# EAGLE design componentes1 (EAGLE 9.6.2)

## Sheet 1 of 2
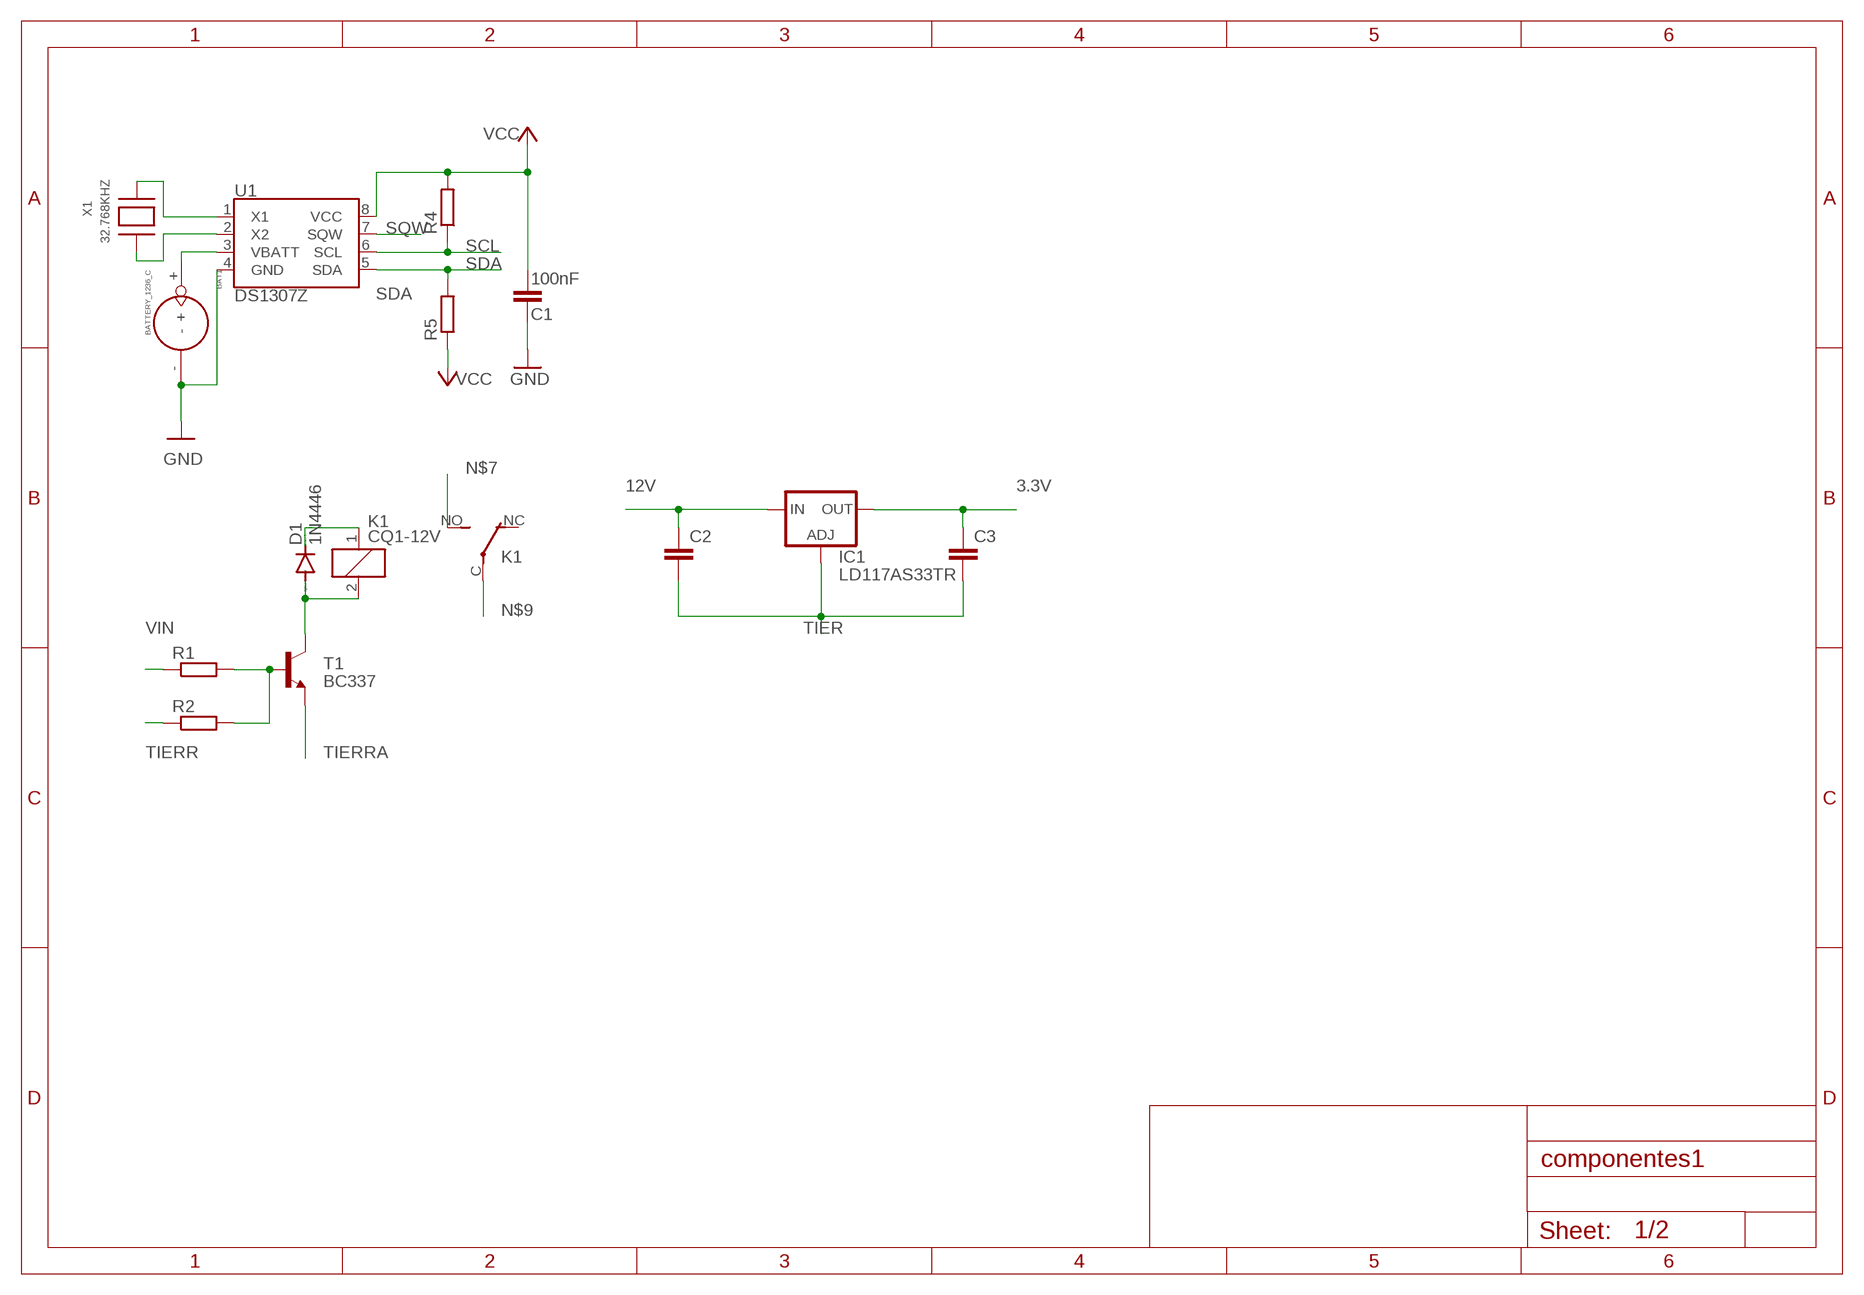
[diagram p0: schematic, sheet 1]

### Parts
BAT1  BATTERY_1236_C  [BATTERY_1236_C]
C1  100nF  C-EUC0603  [C0603]
C2  C-EU050-025X075  [C050-025X075]
C3  C-EU050-025X075  [C050-025X075]
D1  1N4446  [DO35-10]
IC1  LD117AS33TR  [SOT223]
K1  CQ1-12V  [CQ1]
R1  R-EU_0207/10  [0207/10]
R2  R-EU_0207/10  [0207/10]
R4  R-EU_0207/10  [0207/10]
R5  R-EU_0207/10  [0207/10]
T1  BC337  [TO92]
U1  DS1307Z  [SO08-0.15]
X1  32.768KHZ  XTAL-3.2X1.5  [XTAL3215]

### Nets
3.3V: C3.1 IC1.4(OUT) ; also sheet 2
12V: C2.1 IC1.3(IN)
GND: BAT1.- C1.1 U1.4(GND) ; also sheet 2
N$1: U1.1(X1) X1.P$2
N$2: U1.2(X2) X1.P$1
N$3: D1.A K1.2 T1.3(C)
N$4: BAT1.+ U1.3(VBATT)
N$5: D1.C K1.1
N$6: R1.2 R2.2 T1.2(B)
N$7: K1.NO(2:S)
N$9: K1.C(2:P)
SCL: R4.1 U1.6(SCL)
SDA: R5.2 U1.5(SDA)
SQW: U1.7(SQW)
TIER: C2.2 C3.2 IC1.1(ADJ)
TIERR: R2.1
TIERRA: T1.1(E)
VCC: C1.2 R4.2 R5.1 U1.8(VCC) ; also sheet 2
VIN: R1.1
Unconnected: K1.NC(2:O)

## Sheet 2 of 2
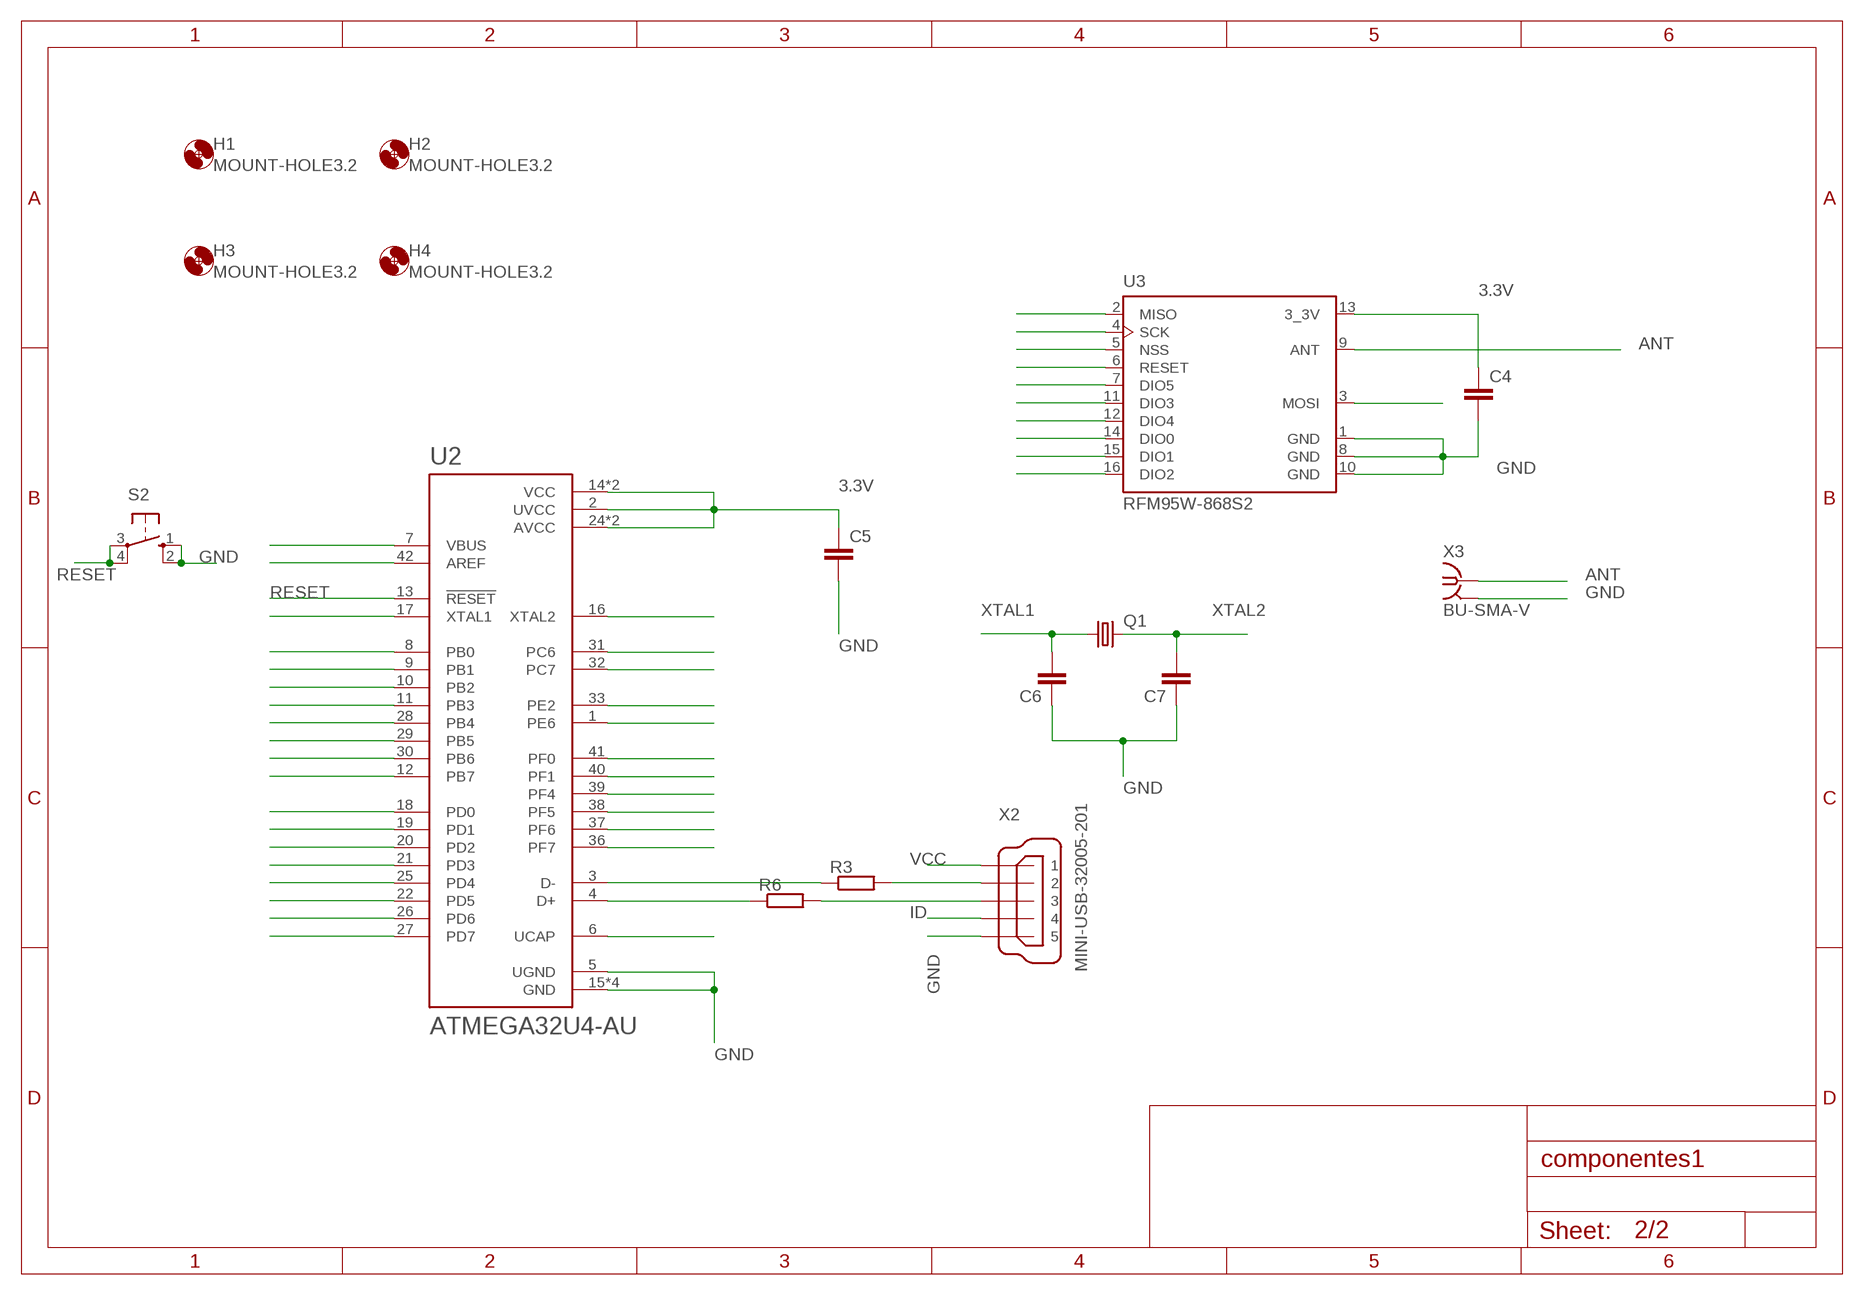
[diagram p1: schematic, sheet 2]

### Parts
C4  C-EU050-025X075  [C050-025X075]
C5  C-EU050-025X075  [C050-025X075]
C6  C-EU050-025X075  [C050-025X075]
C7  C-EU050-025X075  [C050-025X075]
H1  MOUNT-HOLE3.2  [3,2]
H2  MOUNT-HOLE3.2  [3,2]
H3  MOUNT-HOLE3.2  [3,2]
H4  MOUNT-HOLE3.2  [3,2]
Q1  CRYSTALHC49S  [HC49/S]
R3  R-EU_0204/7  [0204/7]
R6  R-EU_0204/7  [0204/7]
S2  40-XX  [B3F-40XX]
U2  ATMEGA32U4-AU  [QFP80P1200X1200X120-44N]
U3  RFM95W-868S2  [XCVR_RFM95W-868S2]
X2  MINI-USB-32005-201  [32005-201]
X3  BU-SMA-V  [BU-SMA-V]

### Nets
3.3V: C4.1 C5.1 U2.2(UVCC) U2.14(VCC) U2.24(AVCC) U2.34(VCC) U2.44(AVCC) U3.13(3_3V) ; also sheet 1
ANT: U3.9(ANT) X3.1
GND: C4.2 C5.2 C6.1 C7.1 S2.1(S) S2.2(S1) U2.5(UGND) U2.15(GND) U2.23(GND) U2.35(GND) U2.43(GND) U3.1(GND) U3.8(GND) U3.10(GND) X2.5 X3.2 X3.3 X3.4 X3.5 ; also sheet 1
ID: X2.4
N$8: U2.7(VBUS)
N$10: U2.42(AREF)
N$11: U2.17(XTAL1)
N$12: U2.8(PB0)
N$13: U2.9(PB1)
N$14: U2.10(PB2)
N$15: U2.11(PB3)
N$16: U2.28(PB4)
N$17: U2.29(PB5)
N$18: U2.30(PB6)
N$19: U2.12(PB7)
N$20: U2.18(PD0)
N$21: U2.19(PD1)
N$22: U2.20(PD2)
N$23: U2.21(PD3)
N$24: U2.25(PD4)
N$25: U2.22(PD5)
N$26: U2.26(PD6)
N$27: U2.27(PD7)
N$28: U2.6(UCAP)
N$29: R3.1 U2.3(D-)
N$30: U2.36(PF7)
N$31: U2.37(PF6)
N$32: U2.38(PF5)
N$33: U2.39(PF4)
N$34: U2.40(PF1)
N$35: U2.41(PF0)
N$36: U2.1(PE6)
N$37: U2.32(PC7)
N$38: U2.31(PC6)
N$39: U2.16(XTAL2)
N$40: R3.2 X2.2
N$41: U3.6(RESET)
N$42: R6.2 X2.3
N$43: R6.1 U2.4(D+)
N$44: U2.33(PE2)
N$45: U3.2(MISO)
N$46: U3.4(SCK)
N$47: U3.5(NSS)
N$49: U3.7(DIO5)
N$50: U3.11(DIO3)
N$51: U3.12(DIO4)
N$52: U3.14(DIO0)
N$53: U3.15(DIO1)
N$54: U3.16(DIO2)
N$58: U3.3(MOSI)
RESET: S2.3(P) S2.4(P1) U2.13(!RESET)
VCC: X2.1 ; also sheet 1
XTAL1: C6.2 Q1.1
XTAL2: C7.2 Q1.2

## Library data of the parts
BAT1 = Itead_BP_110825.lbr:BATTERY_1236_C: SOC004
C1-C7 = rcl:C-EU: CAPACITOR, European symbol; SPICEPREFIX: C
D1 = diode:1N4446: DIODE high speed (Philips)
H1-H4 = holes:MOUNT-HOLE: MOUNTING HOLE with drill center marker
IC1 = v-reg:LD117A?*: Low drop fixed and adjustable positive voltage regulators 1 A Source: http://www.st.com/stonline/products/literature/ds/7194/ld1117axx.pdf
K1 = relay:CQ1-12V: AUTOMOTIVE QUIET RELAY NAiS Source: http://www.mew-europe.com/.. en_ds_61208_0000.pdf; OC_FARNELL: unknown; OC_NEWARK: unknown
Q1 = crystal:CRYSTAL: CRYSTAL; OC_FARNELL: 1667008; OC_NEWARK: unknown
R1-R6 = rcl:R-EU_: RESISTOR, European symbol; SPICEPREFIX: R
S2 = switch-omron:40-XX: OMRON SWITCH; MF: OMRON COMPONENTS USA; MPN: B3F-4000; OC_FARNELL: 176434; OC_NEWARK: 36K3105
T1 = transistor:BC337: NPN TRANSISTOR
U1 = SparkFun-Clocks:DS1307: Maxim DS1307 - I2C Real-time clock (RTC) The DS1307 serial real-time clock (RTC) is a low-power, full binary-coded decimal (BCD) clock/calendar plus 56 bytes of NV SRAM. Address and data are transferred serially through an I2C, bidirectional bus. The clock/calendar provides seconds, minutes, hours, day, date, month, and year information. SparkFun Products: Real Time Clock Module <https://www.sparkfun.com/products/12708> (BOB-12708) Datasheet <https://cdn.sparkfun.com/datasheets/BreakoutBoards/DS1307.pdf>; PROD_ID: IC-08138
U2 = ATMEGA32U4-AU:ATMEGA32U4-AU: ATmega Series 16 MHz 32 KB Flash 2.5 KB SRAM 8-Bit Microcontroller - TQFP-44 Check availability <https://pricing.snapeda.com/parts/ATMEGA32U4-AU/Rochester%20Electronics%2C%20LLC/view-part?ref=eda>; AVAILABILITY: In Stock; DESCRIPTION: AVR AVR® ATmega Microcontroller IC 8-Bit 16MHz 32KB (16K x 16) FLASH 44-TQFP (10x10); MF: Rochester Electronics, LLC; MP: ATMEGA32U4-AU; PACKAGE: None; PRICE: None; PURCHASE-URL: https://pricing.snapeda.com/search/part/ATMEGA32U4-AU/?ref=eda
U3 = RFM95W-868S2:RFM95W-868S2: Mod Txrx Lora +20dbm 868mhz Smd Check availability <https://pricing.snapeda.com/parts/RFM95W-868S2/RF/view-part?ref=eda>; AVAILABILITY: In Stock; DESCRIPTION: General ISM < 1GHz LoRa™ Transceiver Module 868MHz Antenna Not Included Surface Mount; MF: RF; MP: RFM95W-868S2; PACKAGE: SMD-16 Hope Microelectronics; PRICE: None; PURCHASE-URL: https://pricing.snapeda.com/search/part/RFM95W-868S2/?ref=eda
X1 = adafruit:XTAL: Low cost SMT crystals, no capacitors included http://www.ladyada.net/library/eagle
X2 = con-cypressindustries:MINI-USB-: MINI USB-B Conector Source: www.cypressindustries.com; OC_FARNELL: unknown; OC_NEWARK: unknown
X3 = con-coax:BU-SMA-V: FEMALE SMA CONNECTOR Radiall distributor RS 112-3794; OC_FARNELL: unknown; OC_NEWARK: unknown

## Board
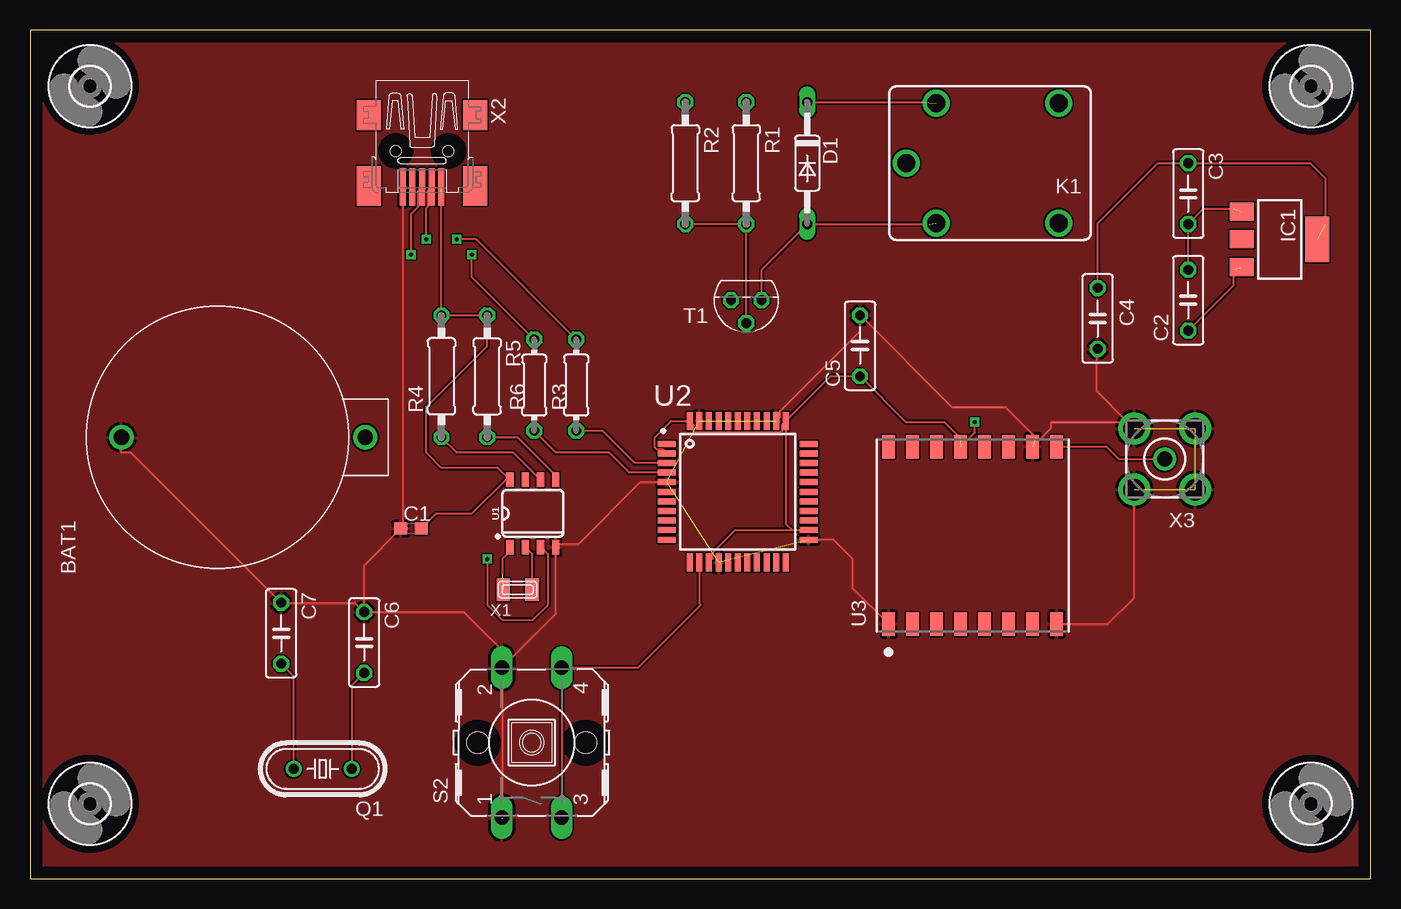
[diagram p2: board, top side]
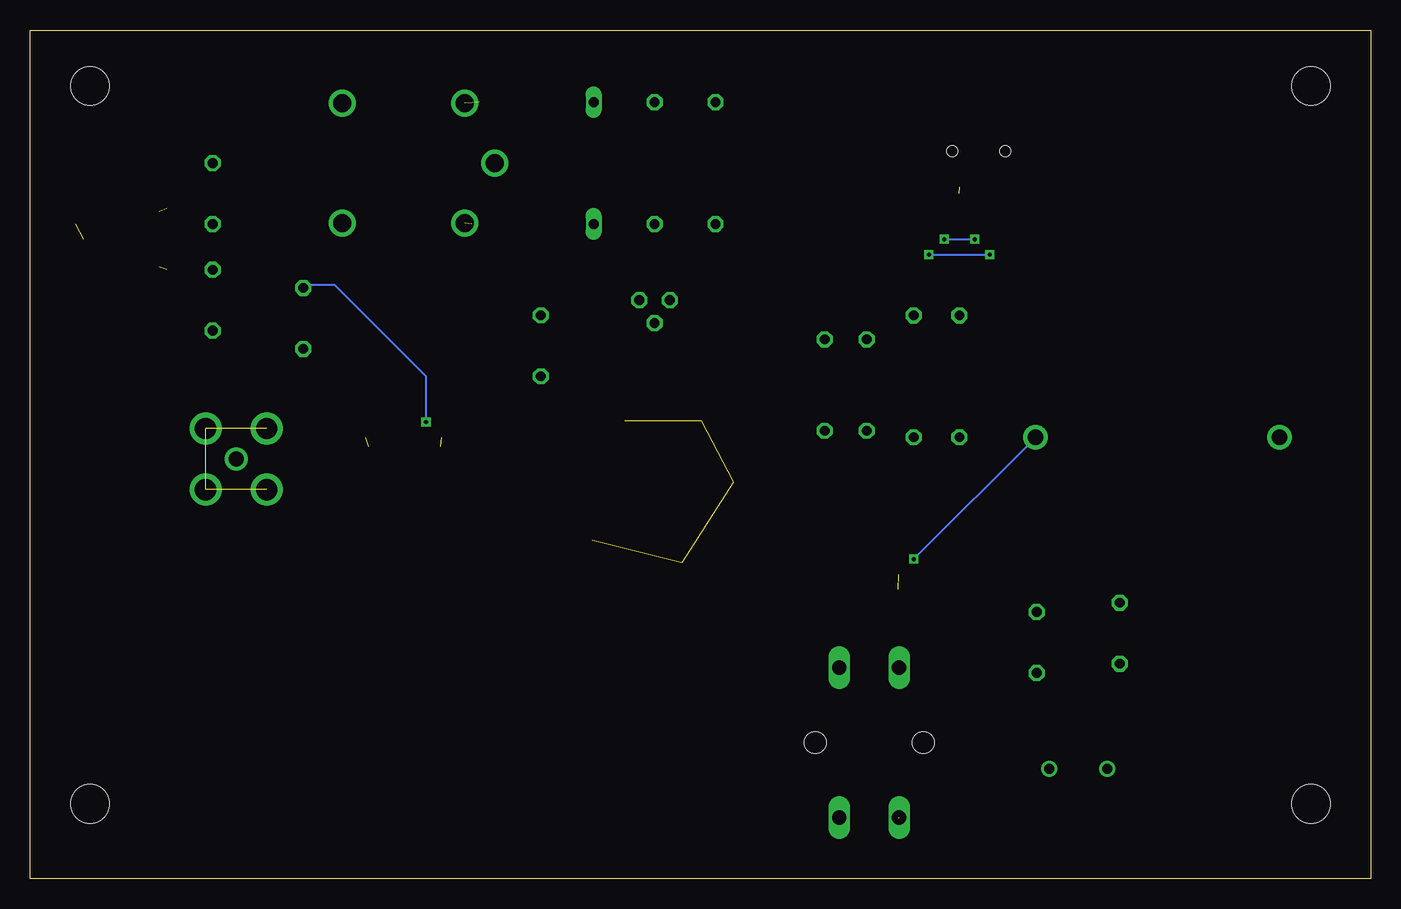
[diagram p3: board, bottom side, seen from below]

Size 111.74 x 70.79 mm. Coordinates in mm from the lower left corner, seen from the top.
Outline: 0,0 111.74,0 111.74,70.79 0,70.79 0,0
Copper layers (1*16): Top 0.035mm / dielectric 1.5mm / Bottom 0.035mm
Design rules "default": minimum track width 6mil, minimum drill 0.35mm, track to track 6mil, track to pad 6mil, pad to pad 6mil, via to via 6mil, smd to smd 6mil, copper to edge 40mil, drill to drill 6mil, minimum pad ring 10mil, minimum via ring 8mil, stop-mask expansion 4mil, vias tented up to drill 0mil, thermal gap 10mil

### Footprints (pad centres in the part's own frame; a part is rotated, then mirrored left to right if it is on the bottom)
BATTERY_1236_C = drill 1.27 pad 2.032: + 0,0; - 0,20.32
C0603 = smd 1.1 x 1: 1 -0.85,0; 2 0.85,0
C050-025X075 = drill 0.813 octagon: 1 -2.54,0; 2 2.54,0
DO35-10 = drill 0.813 long: A 5.08,0; C -5.08,0
3,2 = hole 3.2: 0,0
SOT223 = smd 1.5 x 2: 1 -2.3,-3.15; 2 0,-3.15; 3 2.3,-3.15 | smd 3.8 x 2: 4 0,3.15
CQ1 = drill 1.5: 1 4.5,-5; 2 4.5,5; C 7,0; NC -5.7,-5; NO -5.7,5
HC49/S = drill 0.813: 1 -2.413,0; 2 2.413,0
0207/10 = drill 0.813 octagon: 1 -5.08,0; 2 5.08,0
0204/7 = drill 0.813 octagon: 1 -3.81,0; 2 3.81,0
B3F-40XX = drill 1.194 long: 1 -6.248,2.489; 2 6.248,2.489; 3 -6.248,-2.489; 4 6.248,-2.489 | hole 1.803: 0,-4.496; 0,4.496
TO92 = drill 0.813 octagon: 1 1.27,0; 2 0,1.905; 3 -1.27,0
SO08-0.15 = smd 0.6 x 1.2: 1 -1.905,-2.8; 2 -0.635,-2.8; 3 0.635,-2.8; 4 1.905,-2.8; 5 1.905,2.8; 6 0.635,2.8; 7 -0.635,2.8; 8 -1.905,2.8
QFP80P1200X1200X120-44N = smd 1.5 x 0.5: 1 -5.9,4; 2 -5.9,3.2; 3 -5.9,2.4; 4 -5.9,1.6; 5 -5.9,0.8; 6 -5.9,0; 7 -5.9,-0.8; 8 -5.9,-1.6; 9 -5.9,-2.4; 10 -5.9,-3.2; 11 -5.9,-4; 23 5.9,-4; 24 5.9,-3.2; 25 5.9,-2.4; 26 5.9,-1.6; 27 5.9,-0.8; 28 5.9,0; 29 5.9,0.8; 30 5.9,1.6; 31 5.9,2.4; 32 5.9,3.2; 33 5.9,4 | smd 0.5 x 1.5: 12 -4,-5.9; 13 -3.2,-5.9; 14 -2.4,-5.9; 15 -1.6,-5.9; 16 -0.8,-5.9; 17 0,-5.9; 18 0.8,-5.9; 19 1.6,-5.9; 20 2.4,-5.9; 21 3.2,-5.9; 22 4,-5.9; 34 4,5.9; 35 3.2,5.9; 36 2.4,5.9; 37 1.6,5.9; 38 0.8,5.9; 39 0,5.9; 40 -0.8,5.9; 41 -1.6,5.9; 42 -2.4,5.9; 43 -3.2,5.9; 44 -4,5.9
XCVR_RFM95W-868S2 = smd 1.95 x 1.05: 1 -7.4,7; 2 -7.4,5; 3 -7.4,3; 4 -7.4,1; 5 -7.4,-1; 6 -7.4,-3; 7 -7.4,-5; 8 -7.4,-7; 9 7.4,-7; 10 7.4,-5; 11 7.4,-3; 12 7.4,-1; 13 7.4,1; 14 7.4,3; 15 7.4,5; 16 7.4,7
XTAL3215 = smd 1.1 x 1.9: P$1 1.2,0; P$2 -1.2,0
32005-201 = smd 3.1 x 0.5: 1 3,1.6; 2 3,0.8; 3 3,0; 4 3,-0.8; 5 3,-1.6 | smd 2.5 x 2: M1 -3,-4.45; M2 -3,4.45 | smd 3.3 x 2: M3 2.9,4.45; M4 2.9,-4.45 | hole 0.9: 0,2.2; 0,-2.2
BU-SMA-V = drill 1.27: 1 0,0 | drill 1.778: 2 -2.55,2.55; 3 2.55,2.55; 4 2.55,-2.55; 5 -2.55,-2.55

### Placement (x,y rotation side)
BAT1  27.94,36.83 90 top
C1  31.75,29.21 0 top
C2  96.52,48.26 90 top
C3  96.52,57.15 270 top
C4  88.97,46.74 270 top
C5  69.17,44.46 90 top
C6  27.85,19.72 270 top
C7  20.93,20.49 270 top
D1  64.77,59.69 270 top
H1  5,6.27 0 top
H2  5,66.11 0 top
H3  106.75,6.27 0 top
H4  106.75,66.11 0 top
IC1  104.14,53.34 270 top
K1  80.01,59.69 180 top
Q1  24.39,9.18 180 top
R1  59.69,59.69 270 top
R2  54.61,59.69 270 top
R3  45.52,41.18 90 top
R4  34.29,41.91 90 top
R5  38.1,41.91 270 top
R6  42.02,41.18 90 top
S2  41.81,11.37 90 top
T1  59.69,48.26 180 top
U1  41.91,30.48 0 top
U2  58.98,32.29 0 top
U3  78.55,28.65 90 top
X1  40.64,24.13 0 top
X2  32.67,60.7 270 top
X3  94.56,35.01 180 top

### Tracks (layer width: path | path; a pad name or v marks a point on that pad's centre or on a via)
3.3V  (via drill 0.35)  (2 unrouted)
  Top 0.152: 77.47,36.83 76.2,38.1 72.99,38.1 C5.1 66.71,41.92 U2.34 | 107.95,54.61 107.95,58.42 106.68,59.69 C3.1 93.98,59.69 88.97,54.68 C4.1 | U2.14 56.9,26.71 56.9,27.23 58.76,29.09 63.5,29.09 | 63.5,29.09 U2.24 | U2.2 52.76,35.81 52.23,35.81 52.07,35.98 52.07,36.83 53.43,38.19 U2.44 55.3,37.87 55.3,37.34 55.44,37.21 62.53,37.21 62.66,37.34 62.66,37.87 U2.34 | U2.34 62.98,29.61 63.5,29.09 | U3.13 78.74,37.24 v78.74,38.1
  Bottom 0.152: v78.74,38.1 78.74,41.91 86.36,49.53 88.72,49.53 C4.1
12V  (1 unrouted)
  Top 0.152: C2.1 100.33,49.53 100.33,50.8
ANT
  Top 0.152: U3.9 89.68,36.05 90.72,35.01 X3.1
GND  (9 unrouted)
  Top 0.152: 83.82,36.83 81.28,39.37 76.8,39.37 C5.2 69.17,45.7 62.5,39.03 62.5,38.51 U2.35 | BAT1.- 7.62,35.56 8.4,35.56 C7.1 27.08,23.03 C6.1 | C6.1 27.85,26.16 C1.1 31.07,29.38 X2.5 | C6.1 36.16,22.26 39.37,19.05 39.32,19 S2.2 | S2.2 39.37,17.57 39.37,5.08 | X3.4 91.45,38.11 | 91.45,38.11 88.93,40.64 88.9,40.64 88.9,44.13 C4.2 | 85.89,21.59 U3.8 89.83,21.25 92.01,23.43 X3.3 | S2.2 43.81,22.11 U1.4 44.07,27.94 45.72,27.94 50.87,33.09 U2.5 | U3.10 85.09,37.59 85.09,38.1 85.11,38.11 91.45,38.11 | U3.1 68.58,24.22 68.58,26.67 66.96,28.29 U2.23
  pour Top: 0,71.12 0,1.27 1.27,0 111.76,0 113.03,1.27 113.03,71.12
N$1  (1 unrouted)
  Top 0.152: U1.1 40,27.3 39.37,26.67 39.37,25.4
N$2
  Top 0.152: X1.P$1 41.84,27.11 U1.2
N$3  (1 unrouted)
  Top 0.152: 74.93,54.61 D1.A 60.96,50.8 T1.3
N$4  (via drill 0.35)
  Top 0.152: v38.1,26.67 38.1,22.86 39.37,21.59 41.91,21.59 43.18,22.86 43.18,27.04 U1.3
  Bottom 0.152: BAT1.+ v38.1,26.67
N$5  (1 unrouted)
  Top 0.152: D1.C 74.32,64.77
N$6
  Top 0.152: T1.2 R1.2 R2.2
N$29
  Top 0.152: U2.3 50.4,34.69 47.72,37.37 R3.1
N$40  (via drill 0.35)
  Top 0.152: R3.2 37.17,53.34 v35.56,53.34 | v33.02,53.34 33.02,55.93 33.15,56.06 33.15,57.38 X2.2
  Bottom 0.152: v35.56,53.34 v33.02,53.34
N$42  (via drill 0.35)
  Top 0.152: R6.2 36.83,50.18 v36.83,52.07 | X2.3 32.35,57.38 32.35,56.06 31.75,55.46 v31.75,52.07
  Bottom 0.152: v36.83,52.07 v31.75,52.07
N$43
  Top 0.152: U2.4 49.93,33.89 48.26,35.56 43.83,35.56 R6.1
N$48  (via drill 0.35)
  other vias: 74.93,64.77
RESET
  Top 0.152: S2.3 S2.4 50.64,17.62 55.88,22.86 55.78,22.96 U2.13
SCL
  Top 0.152: U1.6 40.27,35.56 35.56,35.56 R4.1
SDA
  Top 0.152: U1.5 43.81,33.66 40.64,36.83 R5.2
TIER  (1 unrouted)
  Top 0.152: C2.2 C3.2 97.79,55.88 100.33,55.88
VCC  (1 unrouted)
  Top 0.152: C1.2 33.87,30.48 36.83,30.48 39.63,33.28 U1.8 38.99,34.29 34.29,34.29 33.02,35.56 33.02,39.37 38.1,44.45 R5.1 R4.2 34.29,57.15
XTAL1
  Top 0.152: C6.2 26.8,16.13 Q1.1
XTAL2
  Top 0.152: Q1.2 21.98,16.9 C7.2